# EAGLE board v.0.0.1 (EAGLE 5.11), part 1 of 2
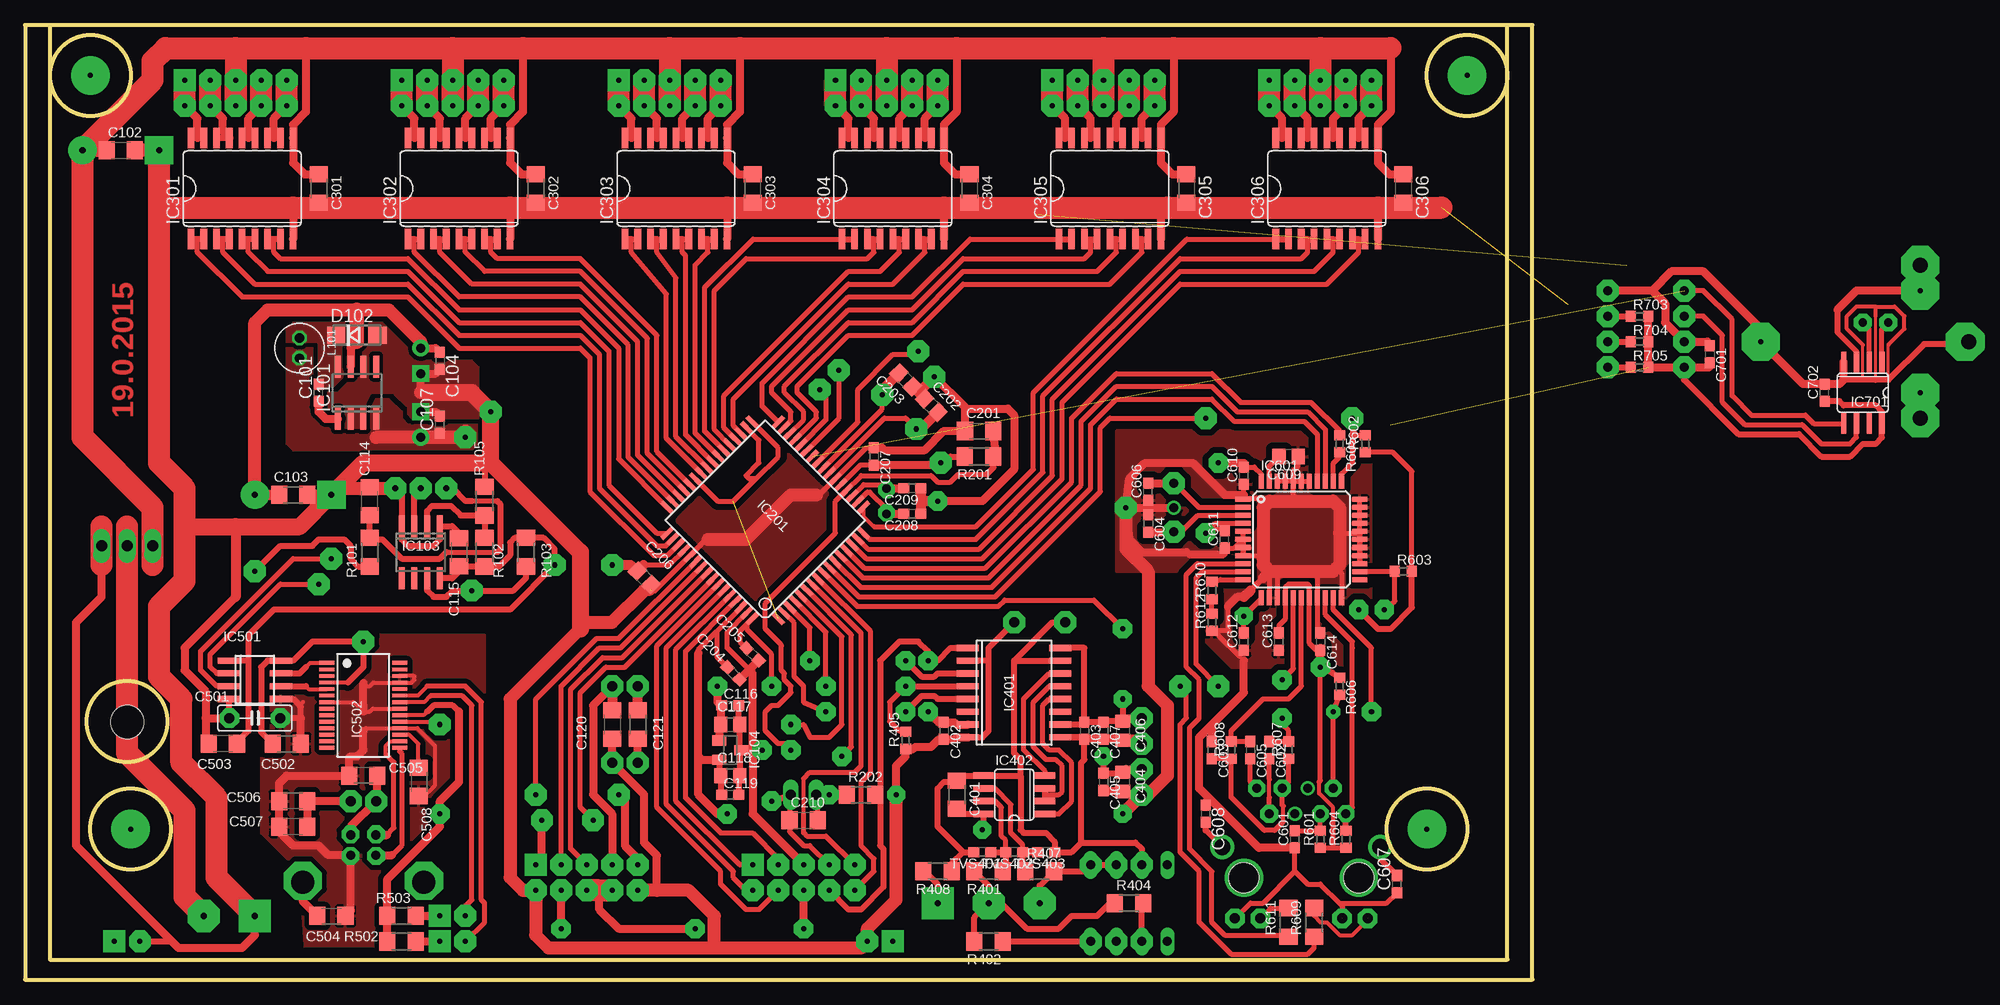
[diagram p7: board, top side]
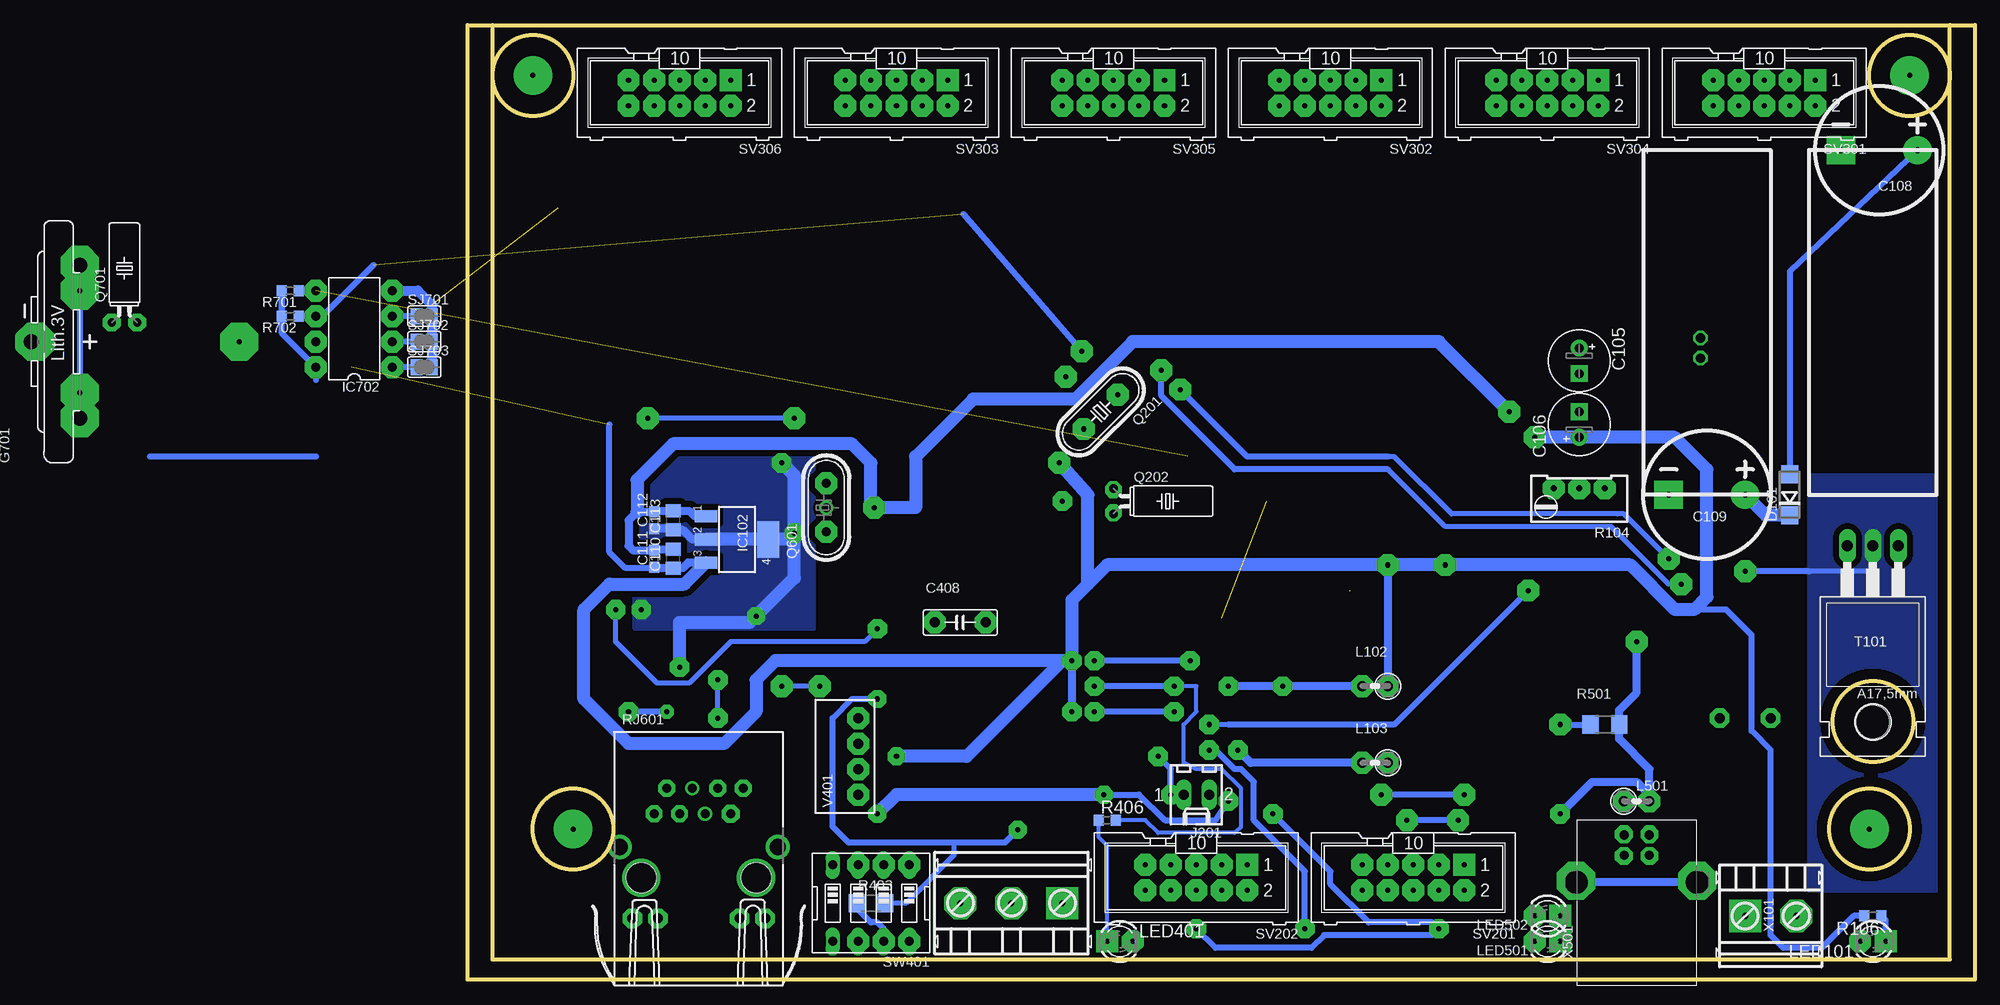
[diagram p8: board, bottom side, seen from below]

Size 150 x 95 mm. Coordinates in mm from the lower left corner, seen from the top.
Outline: 147.5,95 150,95 150,0 0,0 0,95 2.5,95
Outline: 147.5,95 2.5,95
Outline: 2.5,95 2.5,2 147.5,2 147.5,95
Outline: circle at 10.5,15 radius 4
Outline: circle at 139.5,15 radius 4
Outline: circle at 6.5,90 radius 4
Outline: circle at 143.5,90 radius 4
Outline: circle at 10.16,25.72 radius 4
Copper layers (1*16): Top 0.035mm / dielectric 1.5mm / Bottom 0.035mm
Design rules "default *": minimum track width 10mil, minimum drill 19mil, track to track 8mil, track to pad 8mil, pad to pad 8mil, via to via 8mil, smd to smd 8mil, copper to edge 40mil, drill to drill 8mil, minimum pad ring 10mil, minimum via ring 8mil, stop-mask expansion 4mil, vias tented up to drill 0mil, thermal gap 10mil
bRestrict: area 2,92 to 8,98; area 2,2 to 8,8

## Footprints (pad centres in the part's own frame; a part is rotated, then mirrored left to right if it is on the bottom)
C0603 = smd 1.1 x 1: 1 -0.85,0; 2 0.85,0
C1206 = smd 1.6 x 1.8: 1 -1.4,0; 2 1.4,0
E2,5-6,3 = drill 0.9 pad 1.676 round: + -1.27,0 | drill 0.9 pad 1.676 square: - 1.27,0
CP300X100X24 = drill 0.61 pad 2.819 round: + -3.81,0 | drill 0.61 pad 2.819 square: - 3.81,0
C0805 = smd 1.3 x 1.5: 1 -0.95,0; 2 0.95,0
C050-025X075 = drill 1 octagon: 1 -2.54,0; 2 2.54,0
DO214AC = smd 1.8 x 1.7: A 2.05,0; C -2.05,0
CR2325/1VG = drill 1.5 pad 3.15 octagon: + 7.62,-1.27; +@1 -7.62,-1.27; - 0,3.556
SO08 = smd 0.6 x 2.2: 1 -1.905,-2.6; 2 -0.635,-2.6; 3 0.635,-2.6; 4 1.905,-2.6; 5 1.905,2.6; 6 0.635,2.6; 7 -0.635,2.6; 8 -1.905,2.6
SOT223 = smd 1.219 x 2.235: 1 -2.311,-3.099; 2 0,-3.099; 3 2.311,-3.099 | smd 3.6 x 2.2: 4 0,3.099
SOT23 = smd 1 x 1.4: 1 -0.95,-1.1; 2 0.95,-1.1; 3 0,1.1
TQFP64-HOME = smd 1.524 x 0.457: 1 -7.8,6; 2 -7.8,5.2; 3 -7.8,4.4; 4 -7.8,3.6; 5 -7.8,2.8; 6 -7.8,2; 7 -7.8,1.2; 8 -7.8,0.4; 9 -7.8,-0.4; 10 -7.8,-1.2; 11 -7.8,-2; 12 -7.8,-2.8; 13 -7.8,-3.6; 14 -7.8,-4.4; 15 -7.8,-5.2; 16 -7.8,-6; 33 7.8,-6; 34 7.8,-5.2; 35 7.8,-4.4; 36 7.8,-3.6; 37 7.8,-2.8; 38 7.8,-2; 39 7.8,-1.2; 40 7.8,-0.4; 41 7.8,0.4; 42 7.8,1.2; 43 7.8,2; 44 7.8,2.8; 45 7.8,3.6; 46 7.8,4.4; 47 7.8,5.2; 48 7.8,6 | smd 0.457 x 1.524: 17 -6,-7.8; 18 -5.2,-7.8; 19 -4.4,-7.8; 20 -3.6,-7.8; 21 -2.8,-7.8; 22 -2,-7.8; 23 -1.2,-7.8; 24 -0.4,-7.8; 25 0.4,-7.8; 26 1.2,-7.8; 27 2,-7.8; 28 2.8,-7.8; 29 3.6,-7.8; 30 4.4,-7.8; 31 5.2,-7.8; 32 6,-7.8; 49 6,7.8; 50 5.2,7.8; 51 4.4,7.8; 52 3.6,7.8; 53 2.8,7.8; 54 2,7.8; 55 1.2,7.8; 56 0.4,7.8; 57 -0.4,7.8; 58 -1.2,7.8; 59 -2,7.8; 60 -2.8,7.8; 61 -3.6,7.8; 62 -4.4,7.8; 63 -5.2,7.8; 64 -6,7.8
SO18W = smd 0.66 x 2.032: 1 -5.08,-5.029; 2 -3.81,-5.029; 3 -2.54,-5.029; 4 -1.27,-5.029; 5 0,-5.029; 6 1.27,-5.029; 7 2.54,-5.029; 8 3.81,-5.029; 9 5.08,-5.029; 10 5.08,5.029; 11 3.81,5.029; 12 2.54,5.029; 13 1.27,5.029; 14 0,5.029; 15 -1.27,5.029; 16 -2.54,5.029; 17 -3.81,5.029; 18 -5.08,5.029
SO-16W = smd 0.635 x 2.2: 1 -4.445,-4.6; 2 -3.175,-4.6; 3 -1.905,-4.6; 4 -0.635,-4.6; 5 0.635,-4.6; 6 1.905,-4.6; 7 3.175,-4.6; 8 4.445,-4.6; 9 4.445,4.6; 10 3.175,4.6; 11 1.905,4.6; 12 0.635,4.6; 13 -0.635,4.6; 14 -1.905,4.6; 15 -3.175,4.6; 16 -4.445,4.6
SO08' = smd 0.66 x 2.032: 1 -1.905,-3.073; 2 -0.635,-3.073; 3 0.635,-3.073; 4 1.905,-3.073; 5 1.905,3.073; 6 0.635,3.073; 7 -0.635,3.073; 8 -1.905,3.073
SO8 = smd 0.6 x 2.2: 1 -1.905,-2.6; 2 -0.635,-2.6; 3 0.635,-2.6; 4 1.905,-2.6; 5 1.905,2.6; 6 0.635,2.6; 7 -0.635,2.6; 8 -1.905,2.6
SSOP28 = smd 0.381 x 1.499: 1 -4.225,-3.625; 2 -3.575,-3.625; 3 -2.925,-3.625; 4 -2.275,-3.625; 5 -1.625,-3.625; 6 -0.975,-3.625; 7 -0.325,-3.625; 8 0.325,-3.625; 9 0.975,-3.625; 10 1.625,-3.625; 11 2.275,-3.625; 12 2.925,-3.625; 13 3.575,-3.625; 14 4.225,-3.625; 15 4.225,3.625; 16 3.575,3.625; 17 2.925,3.625; 18 2.275,3.625; 19 1.625,3.625; 20 0.975,3.625; 21 0.325,3.625; 22 -0.325,3.625; 23 -0.975,3.625; 24 -1.625,3.625; 25 -2.275,3.625; 26 -2.925,3.625; 27 -3.575,3.625; 28 -4.225,3.625
TQFP44 = smd 1.5 x 0.5: 1 -5.8,4; 2 -5.8,3.2; 3 -5.8,2.4; 4 -5.8,1.6; 5 -5.8,0.8; 6 -5.8,0; 7 -5.8,-0.8; 8 -5.8,-1.6; 9 -5.8,-2.4; 10 -5.8,-3.2; 11 -5.8,-4; 23 5.8,-4; 24 5.8,-3.2; 25 5.8,-2.4; 26 5.8,-1.6; 27 5.8,-0.8; 28 5.8,0; 29 5.8,0.8; 30 5.8,1.6; 31 5.8,2.4; 32 5.8,3.2; 33 5.8,4 | smd 0.5 x 1.5: 12 -4,-5.8; 13 -3.2,-5.8; 14 -2.4,-5.8; 15 -1.6,-5.8; 16 -0.8,-5.8; 17 0,-5.8; 18 0.8,-5.8; 19 1.6,-5.8; 20 2.4,-5.8; 21 3.2,-5.8; 22 4,-5.8; 34 4,5.8; 35 3.2,5.8; 36 2.4,5.8; 37 1.6,5.8; 38 0.8,5.8; 39 0,5.8; 40 -0.8,5.8; 41 -1.6,5.8; 42 -2.4,5.8; 43 -3.2,5.8; 44 -4,5.8
SO8' = smd 0.508 x 2.032: 1 -1.905,-3.073; 2 -0.635,-3.073; 3 0.635,-3.073; 4 1.905,-3.073; 5 1.905,3.073; 6 0.635,3.073; 7 -0.635,3.073; 8 -1.905,3.073
DIL8-NEW = drill 0.9 pad 1.524 square: 1 -3.81,-3.81 | drill 0.9 pad 1.524 octagon: 2 -1.27,-3.81; 3 1.27,-3.81; 4 3.81,-3.81; 5 3.81,3.81; 6 1.27,3.81; 7 -1.27,3.81; 8 -3.81,3.81
6410-02 = drill 1.016 long: 1 1.27,0; 2 -1.27,0
CW45-V = drill 0.9 pad 1.422 octagon: P$1 -1,0; P$2 1,0
0207/2V = drill 1 octagon: 1 -1.27,0; 2 1.27,0
LED3MM-HOME = drill 0.5 pad 2.184 square: A -1.27,0 | drill 0.5 pad 2.184 octagon: K 1.27,0
HC49/S-HOME = drill 0.5 pad 2.184 octagon: 1 -2.413,0; 2 2.413,0
TC38H = drill 0.813 round: 1 -1.27,0; 2 1.27,0
HC49U = drill 0.9 round: 1 -2.413,0; 2 -0.027,0; 3 2.413,0
R1206 = smd 1.6 x 1.803: 1 -1.422,0; 2 1.422,0
RTRIM64W = drill 0.61 round: 1 1.27,-2.54; 2 1.27,0; 3 1.27,2.54
R0603 = smd 1 x 1.1: 1 -0.85,0; 2 0.85,0
TS8P8C = drill 0.9 round: 1 -4.445,6.35; 2 -3.175,8.89; 3 -1.905,6.35; 4 -0.635,8.89; 5 0.635,6.35; 6 1.905,8.89; 7 3.175,6.35; 8 4.445,8.89 | drill 1 round: 9 -6.63,-4.06; 10 -4.09,-4.06; 11 4.09,-4.06; 12 6.63,-4.06 | drill 1.6 round: M1 -7.875,3.05; M2 7.875,3.05 | hole 3: 5.715,0; -5.715,0
SJ = smd 1.168 x 1.6: 1 -0.762,0; 2 0.762,0
M10-HOME = drill 0.5 pad 2.184 square: 1 -5.08,-1.27 | drill 0.5 pad 2.184 octagon: 2 -5.08,1.27; 3 -2.54,-1.27; 4 -2.54,1.27; 5 0,-1.27; 6 0,1.27; 7 2.54,-1.27; 8 2.54,1.27; 9 5.08,-1.27; 10 5.08,1.27
EDG-04 = drill 0.9 long: 1 -3.81,-3.81; 2 -1.27,-3.81; 3 1.27,-3.81; 4 3.81,-3.81; 5 3.81,3.81; 6 1.27,3.81; 7 -1.27,3.81; 8 -3.81,3.81
TO220 = drill 1.118 long: 1 -2.54,-6.35; 2 0,-6.35; 3 2.54,-6.35 | hole 3.302: 0,11.176
D0603 = smd 1.1 x 1: 1 -0.85,0; 2 0.85,0
TME = drill 1 square: 1 -3.81,0 | drill 1 round: 2 -1.27,0; 3 1.27,0; 4 3.81,0
AWG/2-H = drill 0.61 pad 3.2 square: 1 2.54,0 | drill 0.61 pad 3.2 octagon: 2 -2.54,0
AWG/3-H = drill 0.61 pad 3.2 square: 1 5.08,0 | drill 0.61 pad 3.2 octagon: 2 0,0; 3 -5.08,0
85-32004-00X = drill 0.92 pad 1.27 round: 1 4.71,-1.25; 2 4.71,1.25; 3 2.71,1.25; 4 2.71,-1.25 | drill 2.3 pad 3 round: M1 0,6.02; M2 0,-6.02

## Placement (x,y rotation side)
C101  10nF  [C0603]  29.21,58.42 90 top
C102  100nF  [C1206]  9.53,82.55 0 top
C103  100nF  [C1206]  26.67,48.26 0 top
C104  100nF  [C0603]  41.27,61.59 270 top
C105  100uF/25V  [E2,5-6,3]  39.37,61.59 270 bottom
C106  100uF/25V  [E2,5-6,3]  39.37,55.24 90 bottom
C107  100nF  [C0603]  41.27,55.24 90 top
C108  4700uF/25V  [CP300X100X24]  9.53,82.55 180 bottom
C109  4700uF/25V  [CP300X100X24]  26.67,48.26 180 bottom
C110  10uF  [C0805]  129.54,41.91 90 bottom
C111  100nF  [C0603]  131.44,41.91 90 bottom
C112  100nF  [C0603]  131.44,45.72 90 bottom
C113  10uF  [C0805]  129.54,45.72 90 bottom
C114  100nF  [C1206]  34.29,47.62 90 top
C115  100nF  [C1206]  43.18,42.55 270 top
C116  100nF  [C0603]  70.17,27.3 0 top
C117  10uF  [C0805]  70.17,25.4 0 top
C118  10uF  [C0805]  70.17,20.32 0 top
C119  100nF  [C0603]  70.17,18.41 0 top
C120  100nF  [C1206]  58.42,25.4 270 top
C121  100nF  [C1206]  60.96,25.4 270 top
C201  100nF  [C1206]  94.93,54.61 0 top
C202  22pF  [C0805]  90.17,57.15 315 top
C203  22pF  [C0805]  87.63,59.69 135 top
C204  100nF  [C0603]  70.48,30.48 135 top
C205  100nF  [C0603]  72.39,32.38 135 top
C206  100nF  [C0805]  61.59,40.01 135 top
C207  100nF  [C0603]  84.45,52.07 270 top
C208  NA  [C0603]  88.27,46.35 180 top
C209  NA  [C0603]  88.27,48.9 180 top
C210  100nF  [C1206]  77.47,15.88 0 top
C301  100nF  [C1206]  29.21,78.74 270 top
C302  100nF  [C1206]  50.8,78.74 270 top
C303  100nF  [C1206]  72.39,78.74 270 top
C304  100nF  [C1206]  93.98,78.74 270 top
C305  100nF  [C1206]  115.57,78.74 270 top
C306  100nF  [C1206]  137.16,78.74 270 top
C401  100nF  [C1206]  92.71,18.41 270 top
C402  100nF  [C0603]  91.44,24.77 270 top
C403  100nF  [C0603]  105.41,24.77 270 top
C404  4.7uF/16V  [C0805]  109.22,19.68 270 top
C405  100nF  [C0603]  107.31,19.68 270 top
C406  10uF  [C0805]  109.22,24.77 270 top
C407  100nF  [C0603]  107.31,24.77 270 top
C408  4.7nF/400V  [C050-025X075]  100.97,35.56 180 bottom
C501  4.7nF/400V  [C050-025X075]  22.86,26.04 0 top
C502  100nF  [C1206]  26.04,23.5 0 top
C503  100nF  [C1206]  19.68,23.5 180 top
C504  10nF  [C1206]  30.48,6.35 0 top
C505  10nF  [C1206]  33.66,20.32 180 top
C506  100nF  [C1206]  26.67,17.78 180 top
C507  4.7uF  [C1206]  26.67,15.24 180 top
C508  100nF  [C1206]  39.19,19.68 270 top
C601  10nF  [C0603]  126.36,13.97 90 top
C602  6.8nF  [C0603]  123.83,22.86 270 top
C603  10nF  [C0603]  118.11,22.86 270 top
C604  20pF  [C0603]  111.76,45.4 270 top
C605  6.8nF  [C0603]  121.92,22.86 270 top
C606  20pF  [C0603]  111.76,48.58 90 top
C607  10nF  [C0603]  136.53,9.53 90 top
C608  10nF  [C0603]  117.47,16.51 270 top
C609  10uF/6.3V  [C0805]  125.73,52.07 180 top
C610  100nF  [C0603]  121.28,50.16 90 top
C611  100nF  [C0603]  119.38,43.81 90 top
C612  100nF  [C0603]  121.28,33.66 90 top
C613  100nF  [C0603]  124.78,33.66 90 top
C614  100nF  [C0603]  128.91,33.66 270 top
C701  100nF  [C0603]  167.64,62.23 270 top  (outside the outline)
C702  100nF  [C0603]  179.07,58.42 90 top  (outside the outline)
D101  SS14  [DO214AC]  18.41,48.26 90 bottom
D102  SS14  [DO214AC]  33.02,64.14 0 top
G701  CR2325/1VG  [CR2325/1VG]  189.87,63.5 90 bottom  (outside the outline)
IC101  LM2675  [SO08]  33.02,58.42 0 top
IC102  NX1117CE33Z  [SOT223]  123.19,43.81 270 bottom
IC103  LM311D  [SO08]  39.37,42.55 180 top
IC104  REF3040  [SOT23]  70.17,22.86 270 top
IC201  MEGA128-A  [TQFP64-HOME]  73.66,45.72 135 top
IC301  [SO18W]  21.59,78.74 0 top
IC302  [SO18W]  43.18,78.74 0 top
IC303  [SO18W]  64.77,78.74 0 top
IC304  [SO18W]  86.36,78.74 0 top
IC305  [SO18W]  107.95,78.74 0 top
IC306  [SO18W]  129.54,78.74 0 top
IC401  ADUM1301BRW  [SO-16W]  98.42,28.57 270 top
IC402  75176 or MAX485CSA  [SO08']  98.42,18.41 90 top
IC501  ADUM1201  [SO8]  22.86,29.84 270 top
IC502  FT232RL  [SSOP28]  33.66,27.3 270 top
IC601  ENC424J600-V00  [TQFP44]  127,43.81 0 top
IC701  DS1307ZN  [SO8']  182.88,58.42 180 top  (outside the outline)
IC702  24LC512-I/P  [DIL8-NEW]  161.29,64.77 90 bottom  (outside the outline)
J201  22-27-2021-02  [6410-02]  77.47,18.41 180 bottom
L101  68uH  [CW45-V]  27.3,62.87 270 top
L102  68uH  [0207/2V]  59.69,29.21 180 bottom
L103  WIRE*  [0207/2V]  59.69,21.59 180 bottom
L501  CL22uH CECL  [0207/2V]  33.66,17.78 0 bottom
LED101  [LED3MM-HOME]  10.16,3.81 180 bottom
LED401  [LED3MM-HOME]  85.09,3.81 0 bottom
LED501  [LED3MM-HOME]  42.55,3.81 180 bottom
LED502  [LED3MM-HOME]  42.55,6.35 180 bottom
Q201  16.00 MHz  [HC49/S-HOME]  87,56.52 225 bottom
Q202  32.768 kHz  [TC38H]  85.72,47.62 270 bottom
Q601  25.00MHz  [HC49U]  114.3,46.99 90 bottom
Q701  [TC38H]  184.15,65.41 0 bottom  (outside the outline)
R101  10K  [R1206]  34.29,42.55 270 top
R102  1K  [R1206]  45.72,42.55 270 top
R103  1K  [R1206]  49.85,42.55 90 top
R104  5K  [RTRIM64W]  39.37,47.62 90 bottom
R105  1K  [R1206]  45.72,47.62 270 top
R106  200  [R0603]  10.16,6.35 180 bottom
R201  1K  [R1206]  94.93,52.07 180 top
R202  1K  [R1206]  83.19,18.41 0 top
R401  10  [R1206]  95.89,10.79 180 top
R402  120  [R1206]  95.89,3.81 180 top
R403  560  [R1206]  109.86,7.62 0 bottom
R404  560  [R1206]  109.86,7.62 0 top
R405  5.6K  [R0603]  87.63,23.81 90 top
R406  200  [R0603]  86.36,15.88 0 bottom
R407  10  [R1206]  100.97,10.79 0 top
R408  100  [R1206]  90.81,10.79 180 top
R501  10K  [R1206]  36.83,25.4 180 bottom
R502  360  [R1206]  37.47,3.81 0 top
R503  360  [R1206]  37.47,6.35 0 top
R601  10  [R0603]  128.91,13.97 90 top
R602  5.6K  [R0603]  133.35,53.34 90 top
R603  5.6K  [R0603]  137.16,40.64 0 top
R604  49.9  [R0603]  131.44,13.97 90 top
R605  100  [R0603]  130.81,53.34 270 top
R606  49.9  [R0603]  130.81,29.21 270 top
R607  49.9  [R0603]  125.73,22.86 90 top
R608  49.9  [R0603]  120.02,22.86 90 top
R609  200  [R1206]  128.27,5.71 90 top
R610  2.4K  [R0603]  118.11,38.73 90 top
R611  200  [R1206]  125.73,5.71 90 top
R612  10K  [R0603]  118.11,35.56 90 top
R701  1K  [R0603]  167.64,68.58 180 bottom  (outside the outline)
R702  1K  [R0603]  167.64,66.04 180 bottom  (outside the outline)
R703  5.6K  [R0603]  160.66,66.04 0 top  (outside the outline)
R704  5.6K  [R0603]  160.66,63.5 0 top  (outside the outline)
R705  5.6K  [R0603]  160.66,60.96 0 top  (outside the outline)
RJ601  TS8P8C  [TS8P8C]  127,10.16 0 bottom
SJ701  [SJ]  154.31,66.04 0 bottom  (outside the outline)
SJ702  [SJ]  154.31,63.5 0 bottom  (outside the outline)
SJ703  [SJ]  154.31,60.96 0 bottom  (outside the outline)
SV201  BH10S  [M10-HOME]  55.88,10.16 180 bottom
SV202  BH10S  [M10-HOME]  77.47,10.16 180 bottom
SV301  BH10S  [M10-HOME]  20.95,88.27 180 bottom
SV302  BH10S  [M10-HOME]  64.14,88.27 180 bottom
SV303  BH10S  [M10-HOME]  107.31,88.27 180 bottom
SV304  BH10S  [M10-HOME]  42.55,88.27 180 bottom
SV305  BH10S  [M10-HOME]  85.72,88.27 180 bottom
SV306  BH10S  [M10-HOME]  128.91,88.27 180 bottom
SW401  [EDG-04]  109.86,7.62 180 bottom
T101  IRF4905  [TO220]  10.16,36.83 180 bottom
TVS401  CDS3C09GTA  [D0603]  95.25,12.7 180 top
TVS402  CDS3C09GTA  [D0603]  98.42,12.7 180 top
TVS403  CDS3C09GTA  [D0603]  101.6,12.7 180 top
V401  AM1S-0505S-NZ  [TME]  111.12,22.23 90 bottom
X101  [AWG/2-H]  20.32,6.35 180 bottom
X401  [AWG/3-H]  95.89,7.62 0 bottom
X501  MINI-USB_SHIELD4P-85-32004-30X-1  [85-32004-00X]  33.66,9.69 90 bottom